# Altium schematic sheet SINUX_F1_IO.SchDoc
size 420 x 297 mm
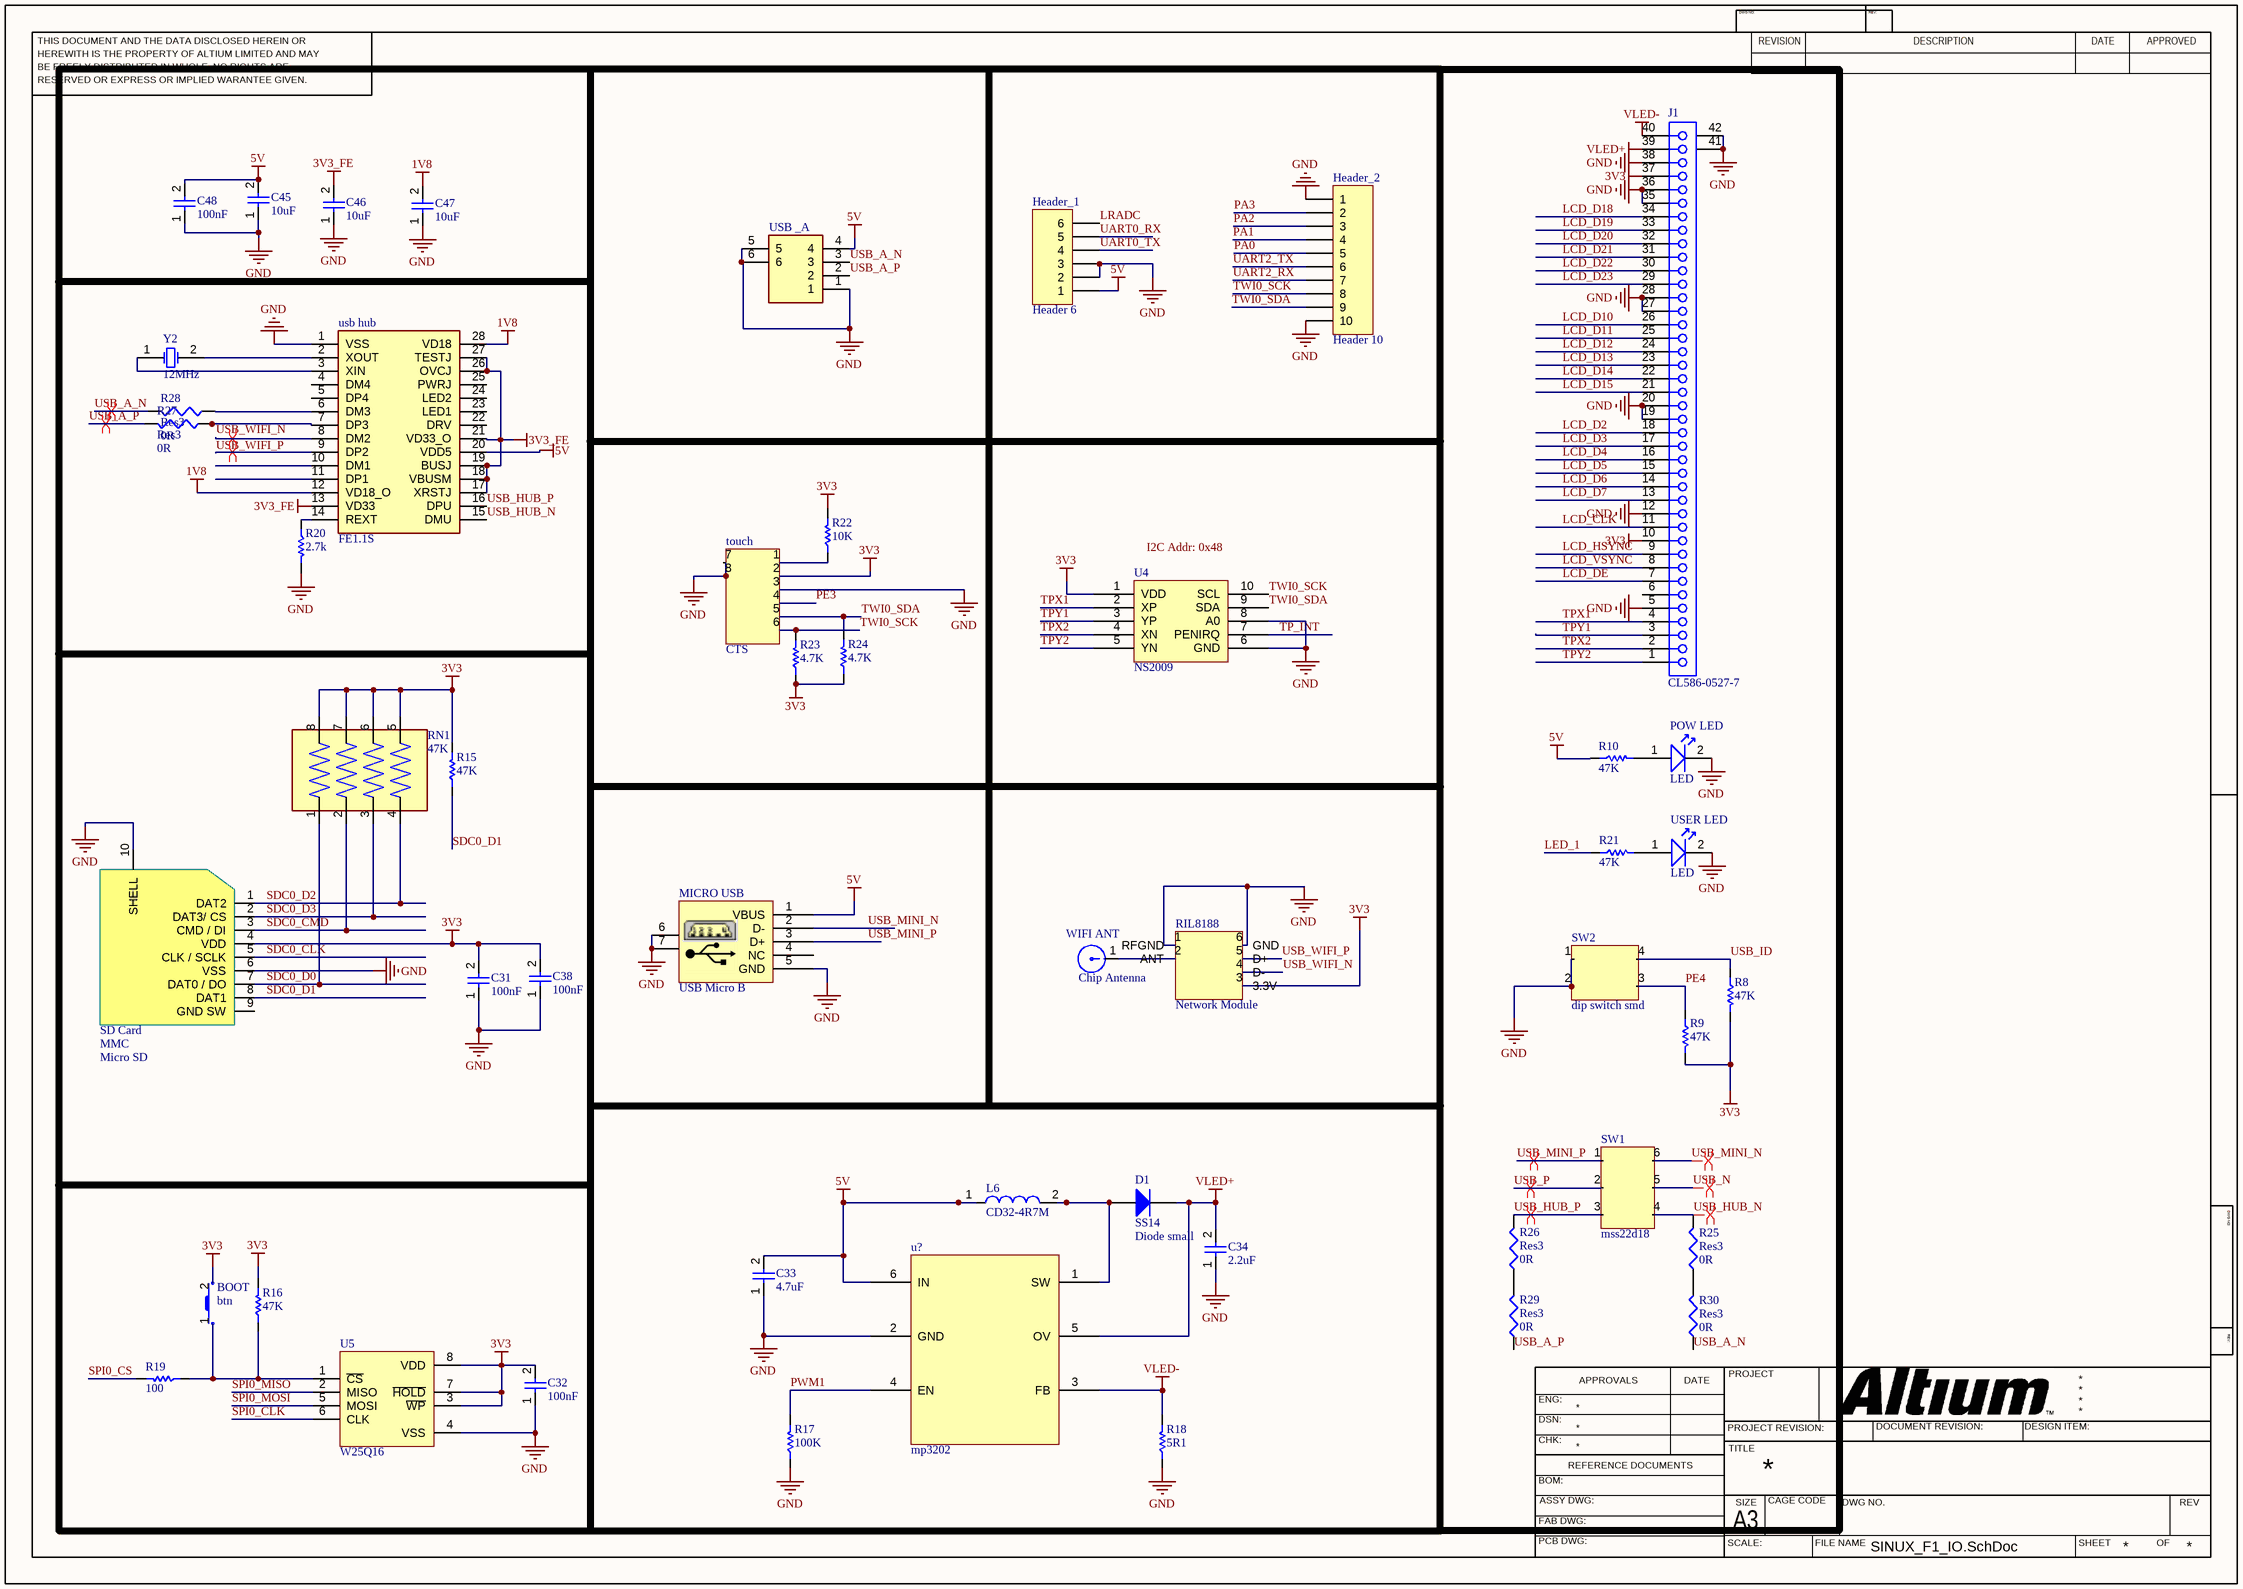
[diagram p0: SINUX_F1_IO.SchDoc]

## Parts
BOOT  btn  [btn]
C31  100nF  [SMD 0805]
C32  100nF  [SMD 0805]
C33  4.7uF  [SMD 0805]
C34  2.2uF  [SMD 0805]
C38  100nF  [SMD 0805]
C45  10uF  [SMD 0805]
C46  10uF  [SMD 0805]
C47  10uF  [SMD 0805]
C48  100nF  [SMD 0805]
D1  SS14  [Diode small SMD]
Header_1  Header 6  [HDR1X6]
Header_2  Header 10  [HDR1X10]
J1  CL586-0527-7  [FH12-40S-0.5SH]
L6  CD32-4R7M  [CD324R7M]
MICRO_USB  USB Micro B  [USB mini]
POW_LED  LED  [0805 LED]
R8  47K  [0805_1/8W]
R9  47K  [0805_1/8W]
R10  47K  [0805_1/8W]
R15  47K  [0805_1/8W]
R16  47K  [0805_1/8W]
R17  100K  [0805_1/8W]
R18  5R1  [0805_1/8W]
R19  100  [0805_1/8W]
R20  2.7k  [0805_1/8W]
R21  47K  [0805_1/8W]
R22  10K  [0805_1/8W]
R23  4.7K  [0805_1/8W]
R24  4.7K  [0805_1/8W]
R25  Res3  value 0R  [J1-0603]
R26  Res3  value 0R  [J1-0603]
R27  Res3  value 0R  [J1-0603]
R28  Res3  value 0R  [J1-0603]
R29  Res3  value 0R  [J1-0603]
R30  Res3  value 0R  [J1-0603]
RIL8188  Network Module  [ril8188]
RN1  47K  [RESCAF80P320X160X60-8N]
SD_Card  MMC  [MICRO SD]
SW1  mss22d18  [MSS22D18]
SW2  dip switch smd  [DIP SWITCH SMD]
touch  CTS  [TS]
U4  NS2009  [SOP50P490X110-11N]
U5  W25Q16  [SOIC 8-Lead  (5.08mm)]
u?  mp3202  [SOP95P275X110-6N]
USB__A  (no value)  [614104150121]
usb_hub  FE1.1S  [SOP64P600X175-28N]
USER_LED  LED  [0805 LED]
WIFI_ANT  Chip Antenna  [2.4GHz Antenna]
Y2  12MHz  [XTAL  SMD]

## Nets
1V8: C47.2 usb_hub.12(VD18_O) usb_hub.28(VD18)
3V3: BOOT.2 C31.2 C32.2 C38.2 J1.10 J1.37 R8.2 R9.2 R15.2 R16.2 R22.2 R23.1 R24.1 RIL8188.3(3.3V) RN1.5 RN1.6 RN1.7 RN1.8 SD_Card.4(VDD) touch.2 U4.1(VDD) U5.3(~{WP}) U5.7(~{HOLD}) U5.8(VDD)
3V3_FE: C46.2 usb_hub.13(VD33) usb_hub.17(XRSTJ) usb_hub.18(VBUSM) usb_hub.19(BUSJ) usb_hub.21(VD33_O) usb_hub.26(OVCJ) usb_hub.27(TESTJ)
5V: C33.2 C45.2 C48.2 Header_1.1 L6.1 MICRO_USB.1(VBUS) R10.1 u?.6(IN) USB__A.4 usb_hub.20(VDD5)
GND: C31.1 C32.1 C33.1 C34.1 C38.1 C45.1 C46.1 C47.1 C48.1 Header_1.2 Header_1.3 Header_2.1 Header_2.10 J1.5 J1.12 J1.19 J1.20 J1.27 J1.28 J1.35 J1.36 J1.38 J1.41(MH1) J1.42(MH2) MICRO_USB.5(GND) MICRO_USB.6 MICRO_USB.7 POW_LED.2 R17.1 R18.1 R20.2 RIL8188.1(RFGND) RIL8188.6(GND) SD_Card.6(VSS) SD_Card.10(SHELL) SW2.1 SW2.2 touch.3 touch.7 touch.8 U4.6(GND) U4.8(A0) U5.4(VSS) u?.2(GND) USB__A.1 USB__A.5 USB__A.6 usb_hub.1(VSS) USER_LED.2
VLED+: C34.2 D1.2(K) J1.39 u?.5(OV)
VLED-: J1.40 R18.2 u?.3(FB)
LCD_CLK: J1.11
LCD_D2: J1.18
LCD_D3: J1.17
LCD_D4: J1.16
LCD_D5: J1.15
LCD_D6: J1.14
LCD_D7: J1.13
LCD_D10: J1.26
LCD_D11: J1.25
LCD_D12: J1.24
LCD_D13: J1.23
LCD_D14: J1.22
LCD_D15: J1.21
LCD_D18: J1.34
LCD_D19: J1.33
LCD_D20: J1.32
LCD_D21: J1.31
LCD_D22: J1.30
LCD_D23: J1.29
LCD_DE: J1.7
LCD_HSYNC: J1.9
LCD_VSYNC: J1.8
LED_1: R21.1
LRADC: Header_1.6
PA0: Header_2.5
PA1: Header_2.4
PA2: Header_2.3
PA3: Header_2.2
PE3: touch.4
PE4: R9.1 SW2.3
PWM1: R17.2 u?.4(EN)
SDC0_CLK: SD_Card.5(CLK_/_SCLK)
SDC0_CMD: RN1.2 SD_Card.3(CMD_/_DI)
SDC0_D0: RN1.1 SD_Card.7(DAT0_/_DO)
SDC0_D1: R15.1 SD_Card.8(DAT1)
SDC0_D2: RN1.4 SD_Card.1(DAT2)
SDC0_D3: RN1.3 SD_Card.2(DAT3/_CS)
SPI0_CLK: U5.6(CLK)
SPI0_CS: R19.2
SPI0_MISO: U5.2(MISO)
SPI0_MOSI: U5.5(MOSI)
TP_INT: U4.7(PENIRQ)
TPX1: J1.4 U4.2(XP)
TPX2: J1.2 U4.4(XN)
TPY1: J1.3 U4.3(YP)
TPY2: J1.1 U4.5(YN)
TWI0_SCK: Header_2.8 R23.2 touch.6 U4.10(SCL)
TWI0_SDA: Header_2.9 R24.2 touch.5 U4.9(SDA)
UART0_RX: Header_1.5
UART0_TX: Header_1.4
UART2_RX: Header_2.7
UART2_TX: Header_2.6
USB_A_N: R28.2 R30.1 USB__A.3
USB_A_P: R27.2 R29.1 USB__A.2
USB_HUB_N: R25.2 SW1.4 usb_hub.15(DMU)
USB_HUB_P: R26.2 SW1.3 usb_hub.16(DPU)
USB_ID: R8.1 SW2.4
USB_MINI_N: MICRO_USB.2(D-) SW1.6
USB_MINI_P: MICRO_USB.3(D+) SW1.1
USB_N: SW1.5
USB_P: SW1.2
USB_WIFI_N: RIL8188.4(D-) usb_hub.8(DM2)
USB_WIFI_P: RIL8188.5(D+) usb_hub.9(DP2)
NetBOOT_1: BOOT.1 R16.1 R19.1 U5.1(~{CS})
NetD1_1: D1.1(A) L6.2 u?.1(SW)
NetPOW_LED_1: POW_LED.1 R10.2
NetR20_1: R20.1 usb_hub.14(REXT)
NetR21_2: R21.2 USER_LED.1
NetR22_1: R22.1 touch.1
NetR25_1: R25.1 R30.2
NetR26_1: R26.1 R29.2
NetR27_1: R27.1 usb_hub.7(DP3)
NetR28_1: R28.1 usb_hub.6(DM3)
NetRIL8188_2: RIL8188.2(ANT) WIFI_ANT.1
Netusb_hub_2: usb_hub.2(XOUT) Y2.2(OSC2)
Netusb_hub_3: usb_hub.3(XIN) Y2.1(OSC1)

Not connected (* = marked no-connect by the designer): J1 6; MICRO_USB 4(NC); SD_Card 9(GND_SW); usb_hub 4(DM4) 5(DP4) 10(DM1) 11(DP1) 22(DRV) 23(LED1) 24(LED2) 25(PWRJ)

## Layout directives
differential pair: USB_A_N, USB_A_P, USB_HUB_N, USB_HUB_P, USB_MINI_N, USB_MINI_P, USB_N, USB_P, USB_WIFI_N, USB_WIFI_P

## Notes on the sheet
- Labels drawn without touching a wire or pin: I2C Addr: 0x48
- THIS DOCUMENT AND THE DATA DISCLOSED HEREIN OR
- HEREWITH IS THE PROPERTY OF ALTIUM LIMITED AND MAY
- DWG NO:
- REVISION
- REV:
- DESCRIPTION
- DATE
- APPROVED
- BE FREELY DISTRIBUTED IN WHOLE. NO RIGHTS ARE
- RESERVED OR EXPRESS OR IMPLIED WARANTEE GIVEN.
- ENG:
- APPROVALS
- PROJECT
- DSN:
- CHK:
- REFERENCE DOCUMENTS
- PROJECT REVISION:
- TITLE
- DOCUMENT REVISION:
- DESIGN ITEM:
- BOM:
- FAB DWG:
- PCB DWG:
- ASSY DWG:
- SCALE:
- A3
- SIZE
- CAGE CODE
- FILE NAME
- DWG NO.
- SHEET
- OF
- REV
- (in symbol Diode) Diode small
- (in symbol MMC) Micro SD

## Library data of the parts
C31 C38 C45-C47 = CAP NON
C32-C34 C48 = CAP NON: Capacitor; Manufacturer Part Number 1: 10uF; Supplier 1: SMD-0805
D1 = Diode
Header_1 = Header 6: Header, 6-Pin; LatestRevisionDate: 17-Jul-2002; LatestRevisionNote: Re-released for DXP Platform.; Publisher: Altium Limited
Header_2 = Header 10: Header, 10-Pin; LatestRevisionDate: 17-Jul-2002; LatestRevisionNote: Re-released for DXP Platform.; Publisher: Altium Limited
J1 = CL586-0527-7: FH12 Series, "Flip-Lock" SMT/ZIF FFC/FPC Connector - 0.5mm Spaced Bottom Contact; Positions: 40; ContactMaterial: Phosphor Bronze; Current: 0.4A; PCB_Layout: Complies with manufacturer's recommendation.; Published: 17-Jul-2002; DatasheetVersion: 13-Nov-2000; PackageVersion: 13-Nov-2000; PackageReference: FH12-40S-0.5SH; Publisher: Altium Limited; PadDimensions: Follow nominal values, Suitable for Wave Soldering, Adjust for Re-flow.; ComponentLink1Description: Manufacturer Link; ComponentLink1URL: http://www.hiroseusa.com/; ComponentLink2Description: Datasheet; ComponentLink2URL: http://www.hirose.co.jp/cataloge_hp/e58605370.pdf
L6 = CD32-4R7M: Inductor; Manufacturer_Name: Shuo Xing; Datasheet Link: http://aitendo3.sakura.ne.jp/aitendo_data/product_img/parts/coil/CD32/CD32.pdf; Height: 2.4mm; Manufacturer_Part_Number: CD32-4R7M
R8-R10 R15-R24 = RESISTOR
R25-R30 = Res3: Resistor; Published: 8-Jun-2000; LatestRevisionDate: 29-May-2009; LatestRevisionNote: IPC-7351 Footprint Added.; PackageReference: J1-0603; Publisher: Altium Limited; PackageDescription: Chip Resistor
RIL8188 = RIL8188
RN1 = CAY16-270J4LF: 27 Ohm Â±5% 62.5mW Power Per Element Isolated Resistor Network/Array Â±200ppm/Â°C 1206 (3216 Metric), Convex, Long Side Terminals; MF: Bourns; Purchase-URL: https://pricing.snapeda.com/search/part/CAY16-270J4LF/?ref=eda; MP: CAY16-270J4LF; Package: 1206 Bourns; Price: None; Availability: Good; SnapEDA_Link: https://www.snapeda.com/parts/CAY16-270J4LF/Bourns/view-part/1118422/?ref=snap; Value: *; Check_prices: https://www.snapeda.com/parts/CAY16-270J4LF/Bourns/view-part/1118422/?ref=eda
U5 = SST25VF032: SERIAL FLASH MEMORY; Manufacturer Part Number 1: W25Q32JV-DTR; Manufacturer 1: Winbond; Supplier 1: 8-Pin SOIC 208-mil
USB__A = 614104150121: Connector; Manufacturer_Name: Wurth Elektronik; Datasheet Link: http://docs-emea.rs-online.com/webdocs/14ff/0900766b814ff8e2.pdf; Manufacturer_Part_Number: 614104150121; Mouser Part Number: 710-614104150121; Mouser Price/Stock: https://www.mouser.co.uk/ProductDetail/Wurth-Elektronik/614104150121?qs=a9WhcLg8qCz3wt21uTqGxw%3D%3D
usb_hub = FE1.1S: Integrated Circuit; Manufacturer_Name: JFD IC; Datasheet Link: https://cdn-shop.adafruit.com/product-files/2991/FE1.1s+Data+Sheet+(Rev.+1.0).pdf; Height: 1.75mm; Manufacturer_Part_Number: FE1.1S
Y2 = XTAL